# EAGLE schematic test2 (EAGLE 7.6.0)
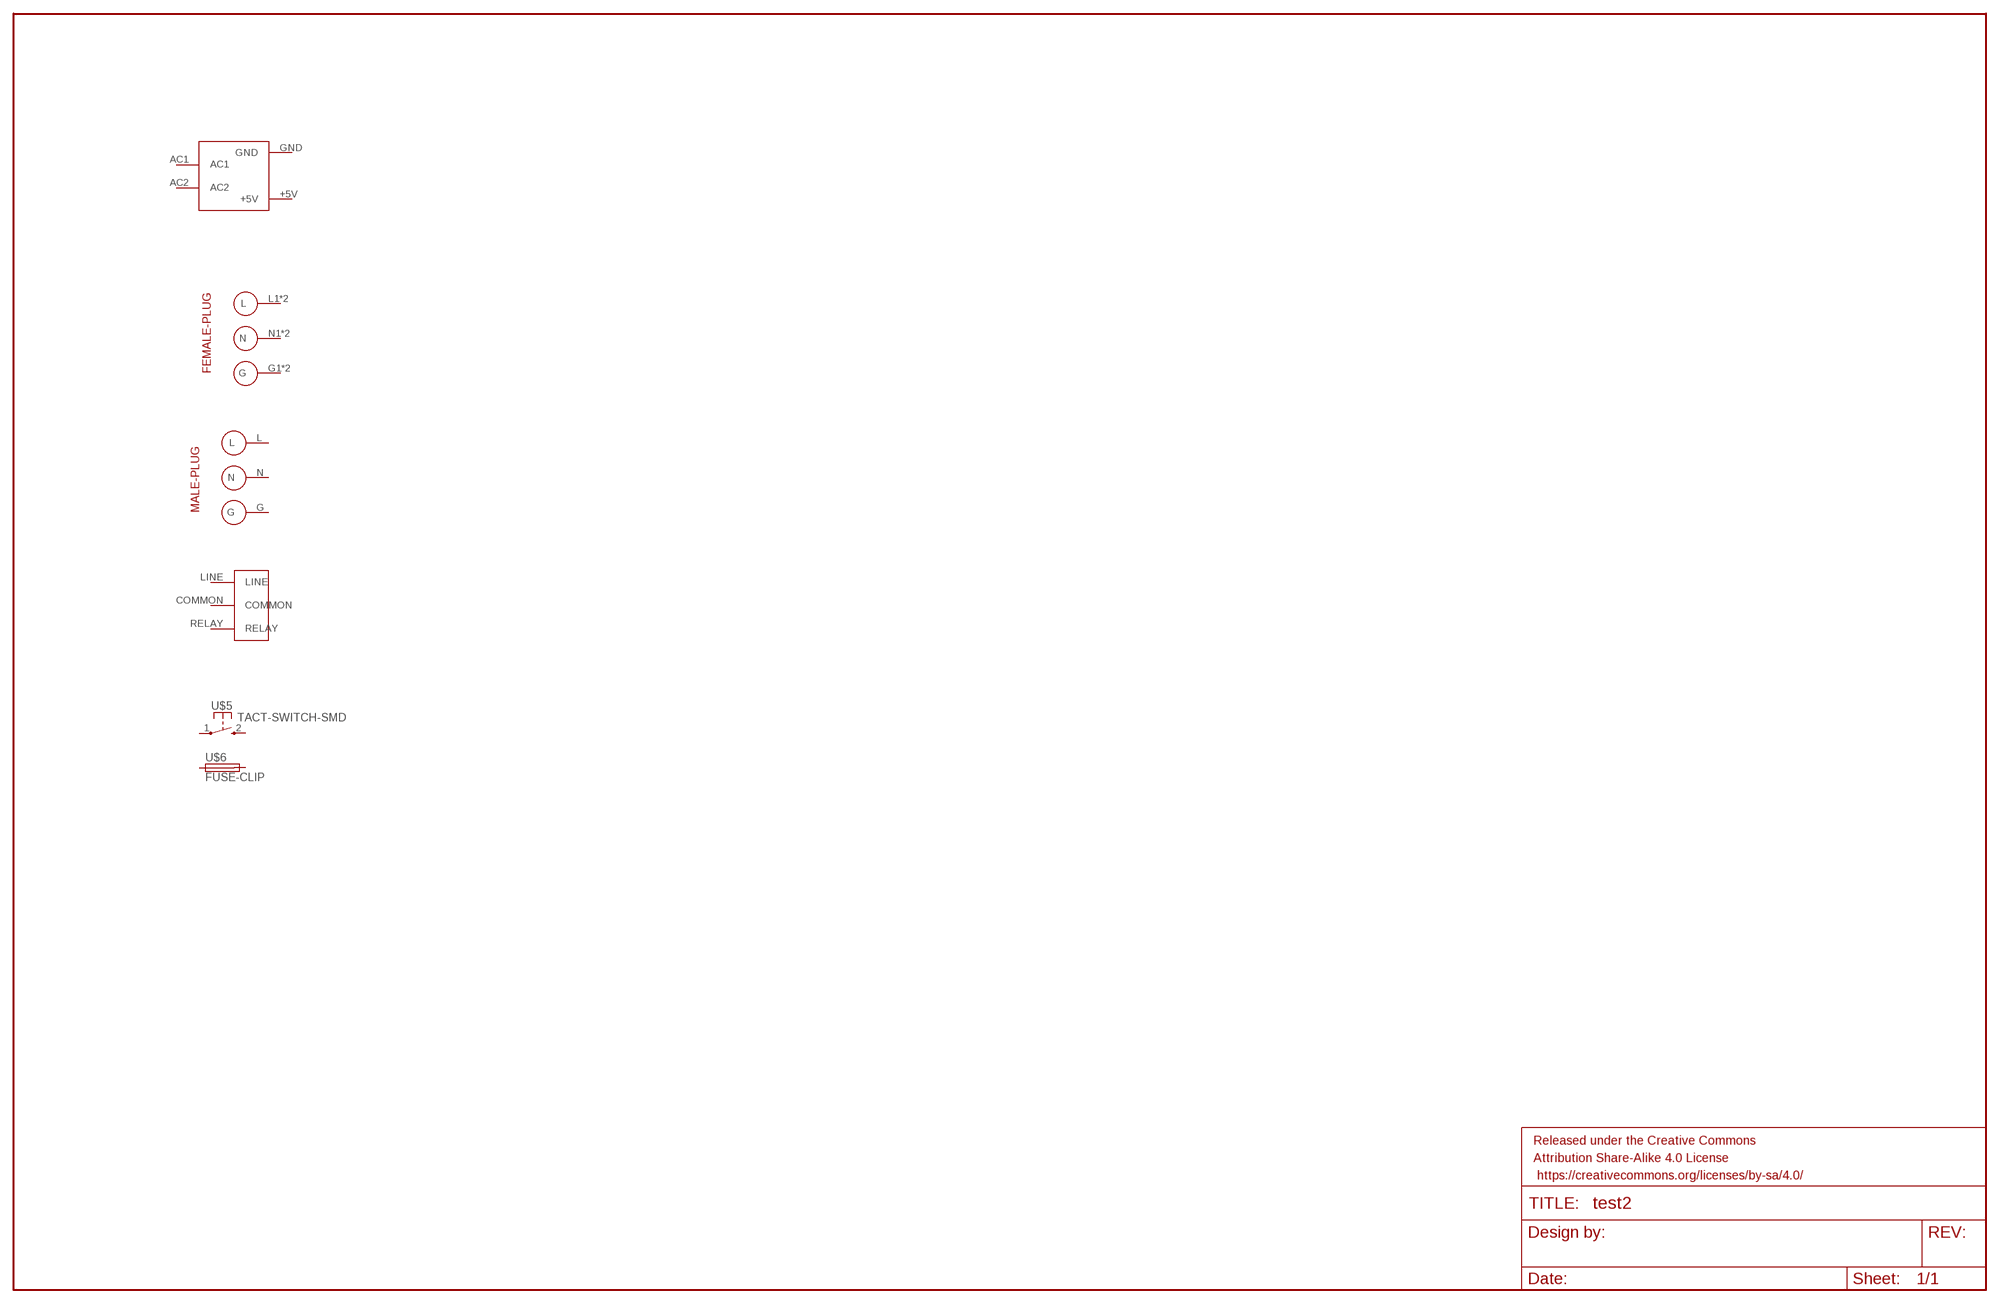
[diagram p0: schematic, sheet 1]

## Parts
FRAME1  FRAME-LEDGER  [CREATIVE_COMMONS]
U$1  HLK-PM01  [HLK-PM01]
U$2  FEMALE-PLUG  [FEMALE-PLUG]
U$3  MALE-PLUG  [MALE-PLUG]
U$4  POWER-RELAY-FOOTPRINT  [POWER-RELAY-FOOTPRINT]
U$5  TACT-SWITCH-SMD  [TACT-SWITCH-SMD]
U$6  FUSE-CLIP  [FUSE-CLIP]
Unconnected: U$1.+5V U$1.AC1 U$1.AC2 U$1.GND U$2.G1(G) U$2.G2(G) U$2.L1(L) U$2.L2(L) U$2.N1(N) U$2.N2(N) U$3.G U$3.L U$3.N U$4.COMMON U$4.LINE U$4.RELAY U$5.1(P) U$5.2(S) U$6.3 U$6.4 U$6.5 U$6.6

## Library data of the parts
FRAME1 = SparkFun-Aesthetics:FRAME-LEDGER: Schematic Frame Standard 11x14 US Ledger frame
U$1 = HLK-PM01:HLK-PM01
U$2 = Male-Female-PLUG:FEMALE-PLUG
U$3 = Male-Female-PLUG:MALE-PLUG
U$4 = Power-Plug-Footprint:POWER-RELAY-FOOTPRINT
U$5 = Tact-Switch-SMD:TACT-SWITCH-SMD: Tong - SMD Tact Switch 2 pins
U$6 = Fuse-Clip:FUSE-CLIP